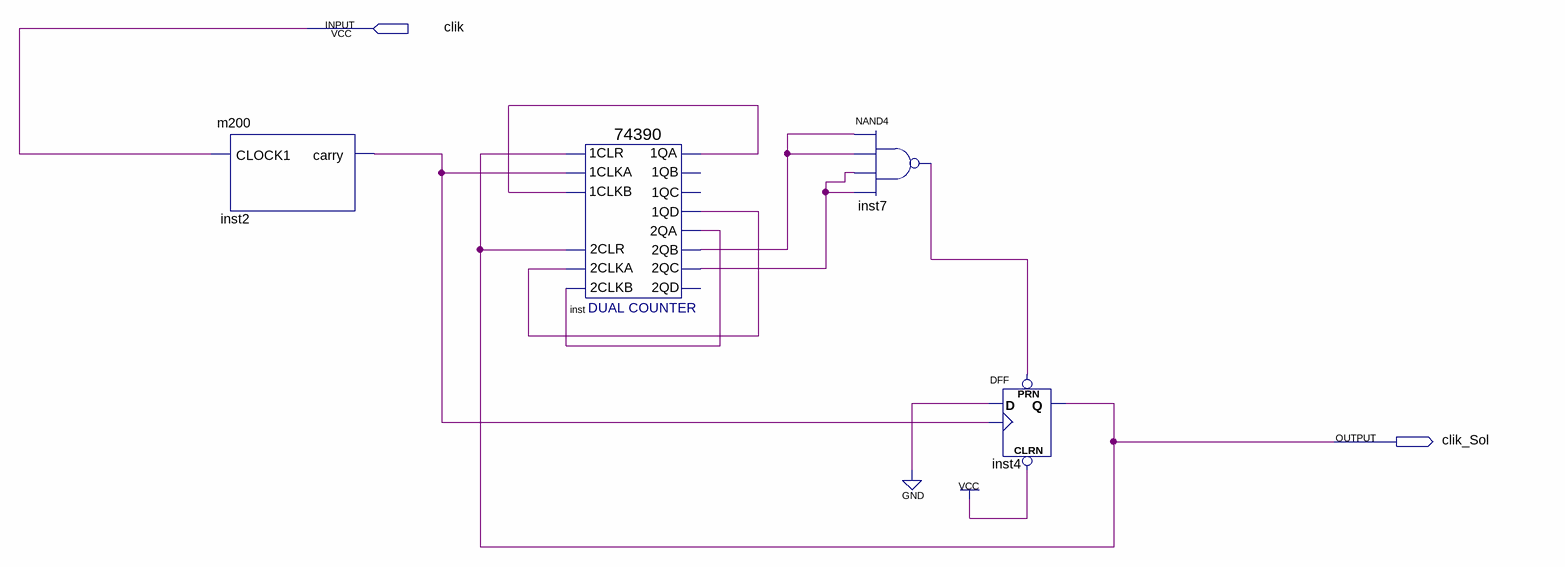
[diagram p0: schematic sheet]
// Quartus schematic Sol.bdf as structural Verilog: 4 symbols, 2 pins
module Sol (
  input  clik,
  output clik_Sol
);

  wire inst2_carry, inst7_out, inst_1qa, inst_1qd, inst_2qa, inst_2qb, inst_2qc;

  m200 inst2 (.CLOCK1(clik), .carry(inst2_carry));
  \74390  inst (
    .\2CLKA (inst_1qd), .\2CLR (clik_Sol), .\2CLKB (inst_2qa), .\1CLR (clik_Sol), .\1CLKA (inst2_carry),
    .\1CLKB (inst_1qa), .\1QA (inst_1qa), .\1QD (inst_1qd), .\2QA (inst_2qa), .\2QB (inst_2qb),
    .\2QC (inst_2qc));  // open: 1QB, 1QC, 2QD
  nand inst7 (inst7_out, inst_2qb, inst_2qb, inst_2qc, inst_2qc);
  DFF inst4 (.CLRN(1'b1), .CLK(inst2_carry), .D(1'b0), .PRN(inst7_out), .Q(clik_Sol));
endmodule
